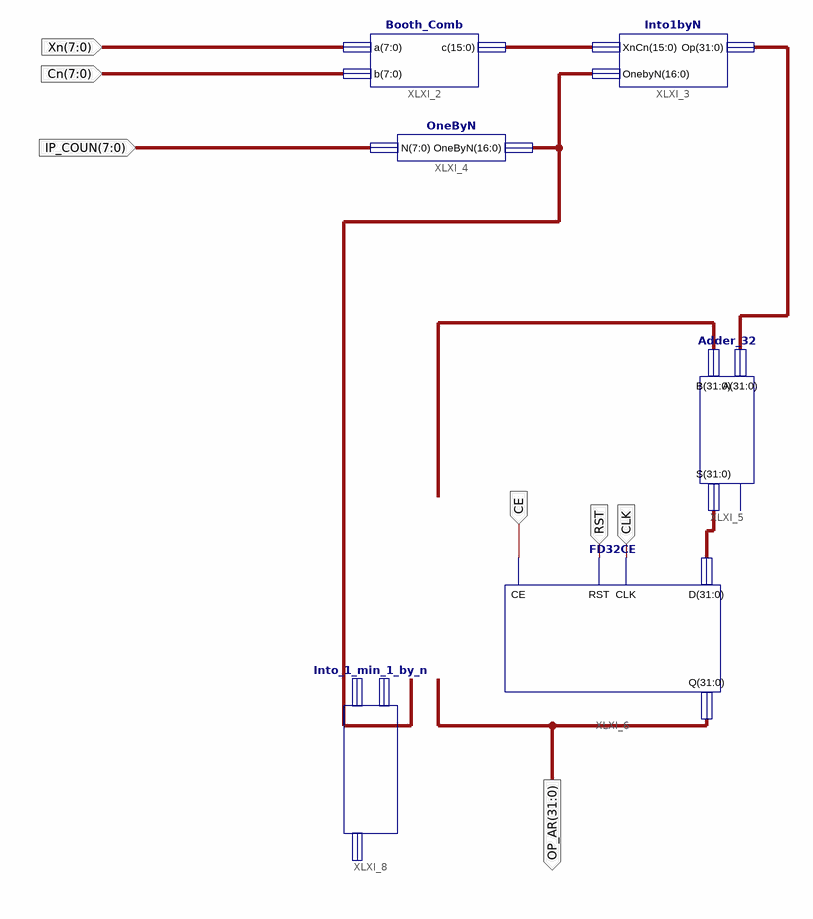
[diagram p0: schematic sheet 1]
// Xilinx ISE schematic Main_Module.sch (spartan3e) as structural Verilog: 6 symbols, 7 ports
module Main_Module (
  input  [7:0] IP_COUN,
  input  RST,
  input  CLK,
  input  [7:0] Xn,
  input  [7:0] Cn,
  input  CE,
  output [31:0] OP_AR
);

  wire [15:0] A_B;
  wire [16:0] One_By_N;
  wire [31:0] ABOneByN, SUM_Xn_CN_One_Min_ByN, Sum_XnCn_Byn;

  Booth_Comb XLXI_2 (.a(Xn), .b(Cn), .c(A_B));
  Into1byN XLXI_3 (.XnCn(A_B), .OnebyN(One_By_N), .Op(ABOneByN));
  OneByN XLXI_4 (.N(IP_COUN), .OneByN(One_By_N));
  Adder_32 XLXI_5 (.A(ABOneByN), .B(SUM_Xn_CN_One_Min_ByN), .S(Sum_XnCn_Byn));  // open: C
  FD32CE XLXI_6 (.CLK(CLK), .RST(RST), .D(Sum_XnCn_Byn), .Q(OP_AR), .CE(CE));
  Into_1_min_1_by_n XLXI_8 (.D(OP_AR), .One_by_N(One_By_N), .Prod(SUM_Xn_CN_One_Min_ByN));
endmodule
